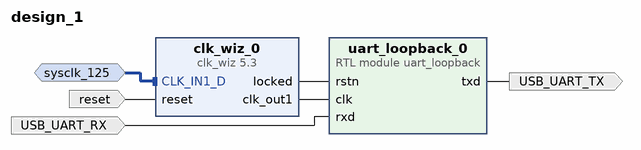
[diagram p0: block diagram of the top level]
# Vivado block design design_1, xcku040-ffva1156-2-e, Vivado 2016.4
create_bd_design design_1

create_bd_intf_port -mode Slave -vlnv xilinx.com:interface:diff_clock_rtl:1.0 sysclk_125
set_property -dict {CONFIG.FREQ_HZ 125000000} [get_bd_intf_ports sysclk_125]
create_bd_port -dir I -type rst reset
set_property -dict {CONFIG.POLARITY ACTIVE_HIGH} [get_bd_ports reset]
create_bd_port -dir I -type data USB_UART_RX
create_bd_port -dir O -type data USB_UART_TX

create_bd_cell -type module -reference uart_loopback uart_loopback_0
create_bd_cell -type ip -vlnv xilinx.com:ip:clk_wiz:5.3 clk_wiz_0
set_property -dict [list \
  CONFIG.USE_BOARD_FLOW true \
  CONFIG.CLK_IN1_BOARD_INTERFACE sysclk_125 \
  CONFIG.RESET_BOARD_INTERFACE reset \
] [get_bd_cells clk_wiz_0]

# ---- connections ----

connect_bd_intf_net -intf_net sysclk_125_1 [get_bd_intf_ports sysclk_125] [get_bd_intf_pins clk_wiz_0/CLK_IN1_D]
connect_bd_net [get_bd_pins clk_wiz_0/locked] [get_bd_pins uart_loopback_0/rstn]
connect_bd_net [get_bd_pins clk_wiz_0/clk_out1] [get_bd_pins uart_loopback_0/clk]
connect_bd_net [get_bd_ports reset] [get_bd_pins clk_wiz_0/reset]
connect_bd_net [get_bd_ports USB_UART_RX] [get_bd_pins uart_loopback_0/rxd]
connect_bd_net [get_bd_pins uart_loopback_0/txd] [get_bd_ports USB_UART_TX]

validate_bd_design
save_bd_design
